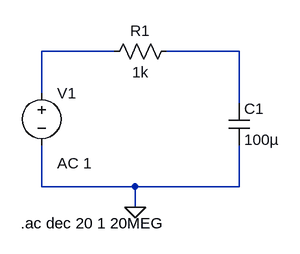
[diagram p0: schematic lp_filter.asc]
lp_filter.asc, the LTspice schematic file:
Version 4
SHEET 1 880 680
WIRE 272 32 160 32
WIRE 464 32 352 32
WIRE 160 96 160 32
WIRE 464 112 464 32
WIRE 160 240 160 176
WIRE 304 240 160 240
WIRE 464 240 464 176
WIRE 464 240 304 240
WIRE 304 272 304 240
FLAG 304 272 0
SYMBOL voltage 160 80 R0
WINDOW 123 24 124 Left 2
WINDOW 39 0 0 Left 2
SYMATTR Value2 AC 1
SYMATTR InstName V1
SYMATTR Value ""
SYMBOL res 368 16 R90
WINDOW 0 0 56 VBottom 2
WINDOW 3 32 56 VTop 2
SYMATTR InstName R1
SYMATTR Value 1k
SYMBOL cap 448 112 R0
SYMATTR InstName C1
SYMATTR Value 100µ
TEXT 128 296 Left 2 !.ac dec 20 1 20MEG

The netlist it stands for:
* lp_filter.asc
V1 N001 0 AC 1
R1 N002 N001 1k
C1 N002 0 100µ
.ac dec 20 1 20MEG
.backanno
.end